# EAGLE design Mouse STM32F401_DB9 v1.1 (EAGLE 7.5.0)
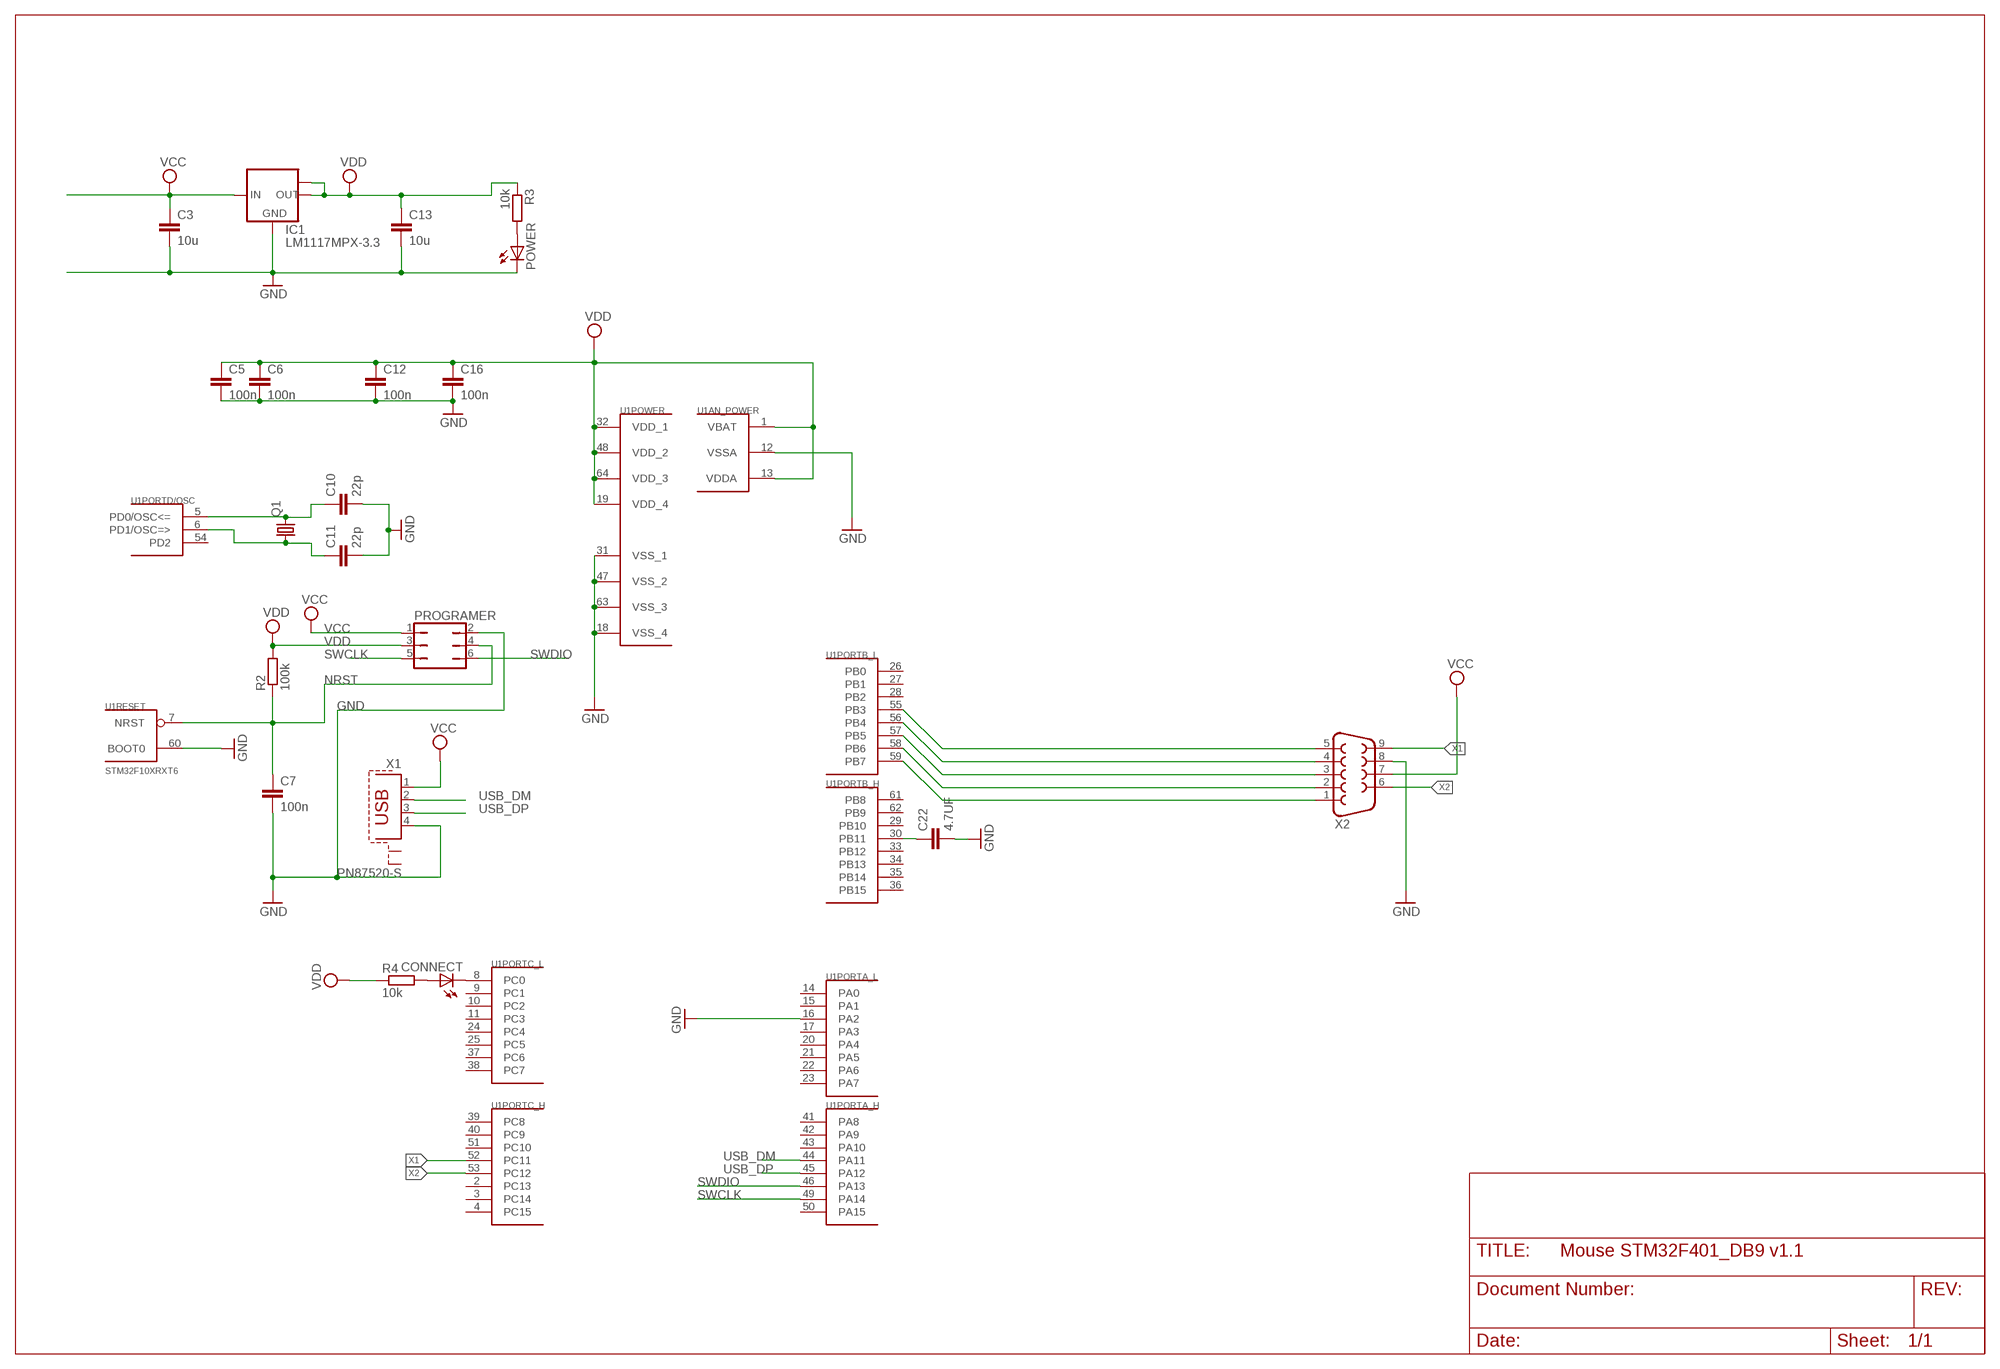
[diagram p0: schematic, sheet 1]

## Parts
C3  10u  C-EUC1206  [C1206]
C5  100n  C-EUC0603  [C0603]
C6  100n  C-EUC0603  [C0603]
C7  100n  C-EUC0603  [C0603]
C10  22p  C-EUC0603  [C0603]
C11  22p  C-EUC0603  [C0603]
C12  100n  C-EUC0603  [C0603]
C13  10u  C-EUC1206  [C1206]
C16  100n  C-EUC0603  [C0603]
C22  4.7UF  C-EUC1206  [C1206]
CONNECT  LEDSML0805  [SML0805]
IC1  LM1117MPX-3.3  [SOT223]
POWER  LEDSML0805  [SML0805]
PROGRAMER  JP3Q  [JP3Q]
Q1  CRYSTALHC49S  [HC49/S]
R2  100k  R-EU_R0603  [R0603]
R3  10k  R-EU_R0603  [R0603]
R4  10k  R-EU_R0603  [R0603]
U1  STM32F10XRXT6  [TQFP64]
X1  PN87520-S  [PN87520-S]
X2  F09HP  [F09HP]

## Nets
GND: C3.2 C5.2 C6.2 C7.2 C10.2 C11.2 C12.2 C13.2 C16.2 C22.2 IC1.1(GND) POWER.C PROGRAMER.2 U1.12(AN_POWER:VSSA) U1.16(PORTA_L:PA2) U1.18(POWER:VSS_4) U1.31(POWER:VSS_1) U1.47(POWER:VSS_2) U1.60(RESET:BOOT0) U1.63(POWER:VSS_3) X1.4 X2.8
N$1: C10.1 Q1.2 U1.5(PORTD/OSC:PD0/OSC<=)
N$2: C11.1 Q1.1 U1.6(PORTD/OSC:PD1/OSC=>)
N$3: CONNECT.C U1.8(PORTC_L:PC0)
N$4: C22.1 U1.30(PORTB_H:PB11)
N$5: U1.55(PORTB_L:PB3) X2.5
N$7: CONNECT.A R4.2
N$8: U1.56(PORTB_L:PB4) X2.4
N$10: U1.58(PORTB_L:PB6) X2.2
N$12: POWER.A R3.2
N$20: U1.59(PORTB_L:PB7) X2.1
N$22: U1.57(PORTB_L:PB5) X2.3
NRST: C7.1 PROGRAMER.4 R2.1 U1.7(RESET:NRST)
SWCLK: PROGRAMER.5 U1.49(PORTA_H:PA14)
SWDIO: PROGRAMER.6 U1.46(PORTA_H:PA13)
USB_DM: U1.44(PORTA_H:PA11) X1.2
USB_DP: U1.45(PORTA_H:PA12) X1.3
VCC: C3.1 IC1.3(IN) PROGRAMER.1 X1.1 X2.7
VDD: C5.1 C6.1 C12.1 C13.1 C16.1 IC1.2(OUT) IC1.TAB(OUT1) PROGRAMER.3 R2.2 R3.1 R4.1 U1.1(AN_POWER:VBAT) U1.13(AN_POWER:VDDA) U1.19(POWER:VDD_4) U1.32(POWER:VDD_1) U1.48(POWER:VDD_2) U1.64(POWER:VDD_3)
X1: U1.52(PORTC_H:PC11) X2.9
X2: U1.53(PORTC_H:PC12) X2.6
Unconnected: U1.2(PORTC_H:PC13) U1.3(PORTC_H:PC14) U1.4(PORTC_H:PC15) U1.9(PORTC_L:PC1) U1.10(PORTC_L:PC2) U1.11(PORTC_L:PC3) U1.14(PORTA_L:PA0) U1.15(PORTA_L:PA1) U1.17(PORTA_L:PA3) U1.20(PORTA_L:PA4) U1.21(PORTA_L:PA5) U1.22(PORTA_L:PA6) U1.23(PORTA_L:PA7) U1.24(PORTC_L:PC4) U1.25(PORTC_L:PC5) U1.26(PORTB_L:PB0) U1.27(PORTB_L:PB1) U1.28(PORTB_L:PB2) U1.29(PORTB_H:PB10) U1.33(PORTB_H:PB12) U1.34(PORTB_H:PB13) U1.35(PORTB_H:PB14) U1.36(PORTB_H:PB15) U1.37(PORTC_L:PC6) U1.38(PORTC_L:PC7) U1.39(PORTC_H:PC8) U1.40(PORTC_H:PC9) U1.41(PORTA_H:PA8) U1.42(PORTA_H:PA9) U1.43(PORTA_H:PA10) U1.50(PORTA_H:PA15) U1.51(PORTC_H:PC10) U1.54(PORTD/OSC:PD2) U1.61(PORTB_H:PB8) U1.62(PORTB_H:PB9) X1.S1 X1.S2

## Library data of the parts
C3 C5-C7 C10-C13 C16 C22 = rcl:C-EU: CAPACITOR, European symbol; SPICEPREFIX: C
CONNECT POWER = led:LED: LED OSRAM: - CHIPLED LG R971, LG N971, LY N971, LG Q971, LY Q971, LO R971, LY R971 LH N974, LH R974 LS Q976, LO Q976, LY Q976 LO Q996 - Hyper CHIPLED LW Q18S LB Q993, LB Q99A, LB R99A - SideLED LS A670, LO A670, LY A670, LG A670, LP A670 LB A673, LV A673, LT A673, LW A673 LH A674 LY A675 LS A676, LA A676, LO A676, LY A676, LW A676 LS A679, LY A679, LG A679 - Hyper Micro SIDELED® LS Y876, LA Y876, LO Y876, LY Y876 LT Y87S - SmartLED LW L88C, LW L88S LB L89C, LB L89S, LG L890 LS L89K, LO L89K, LY L89K LS L896, LA L896, LO L896, LY L896 - TOPLED LS T670, LO T670, LY T670, LG T670, LP T670 LSG T670, LSP T670, LSY T670, LOP T670, LYG T670 LG T671, LOG T671, LSG T671 LB T673, LV T673, LT T673, LW T673 LH T674 LS T676, LA T676, LO T676, LY T676, LB T676, LH T676, LSB T676, LW T676 LB T67C, LV T67C, LT T67C, LS T67K, LO T67K, LY T67K, LW E67C LS E67B, LA E67B, LO E67B, LY E67B, LB E67C, LV E67C, LT E67C LW T67C LS T679, LY T679, LG T679 LS T770, LO T770, LY T770, LG T770, LP T770 LB T773, LV T773, LT T773, LW T773 LH T774 LS E675, LA E675, LY E675, LS T675 LS T776, LA T776, LO T776, LY T776, LB T776 LHGB T686 LT T68C, LB T68C - Hyper Mini TOPLED® LB M676 - Mini TOPLED Santana® LG M470 LS M47K, LO M47K, LY M47K Source: http://www.osram.convergy.de LUXEON: - LUMILED® LXK2-PW12-R00, LXK2-PW12-S00, LXK2-PW14-U00, LXK2-PW14-V00 LXK2-PM12-R00, LXK2-PM12-S00, LXK2-PM14-U00 LXK2-PE12-Q00, LXK2-PE12-R00, LXK2-PE12-S00, LXK2-PE14-T00, LXK2-PE14-U00 LXK2-PB12-K00, LXK2-PB12-L00, LXK2-PB12-M00, LXK2-PB14-N00, LXK2-PB14-P00, LXK2-PB14-Q00 LXK2-PR12-L00, LXK2-PR12-M00, LXK2-PR14-Q00, LXK2-PR14-R00 LXK2-PD12-Q00, LXK2-PD12-R00, LXK2-PD12-S00 LXK2-PH12-R00, LXK2-PH12-S00 LXK2-PL12-P00, LXK2-PL12-Q00, LXK2-PL12-R00 Source: www.luxeon.com KINGBRIGHT: KA-3528ASYC Source: www.kingbright.com
IC1 = lm1117:LM1117MPX-*
PROGRAMER = jumper:JP3Q: JUMPER
Q1 = crystal:CRYSTAL: CRYSTAL; OC_FARNELL: 1667008; OC_NEWARK: unknown
R2-R4 = rcl:R-EU_: RESISTOR, European symbol; SPICEPREFIX: R
U1 = stm32:STM32F10XRXT6: STM32F101/103 64pin LQFP
X1 = con-berg:PN87520-S; OC_FARNELL: unknown; OC_NEWARK: unknown
X2 = con-subd:F09: SUB-D; OC_FARNELL: unknown; OC_NEWARK: unknown

## Board
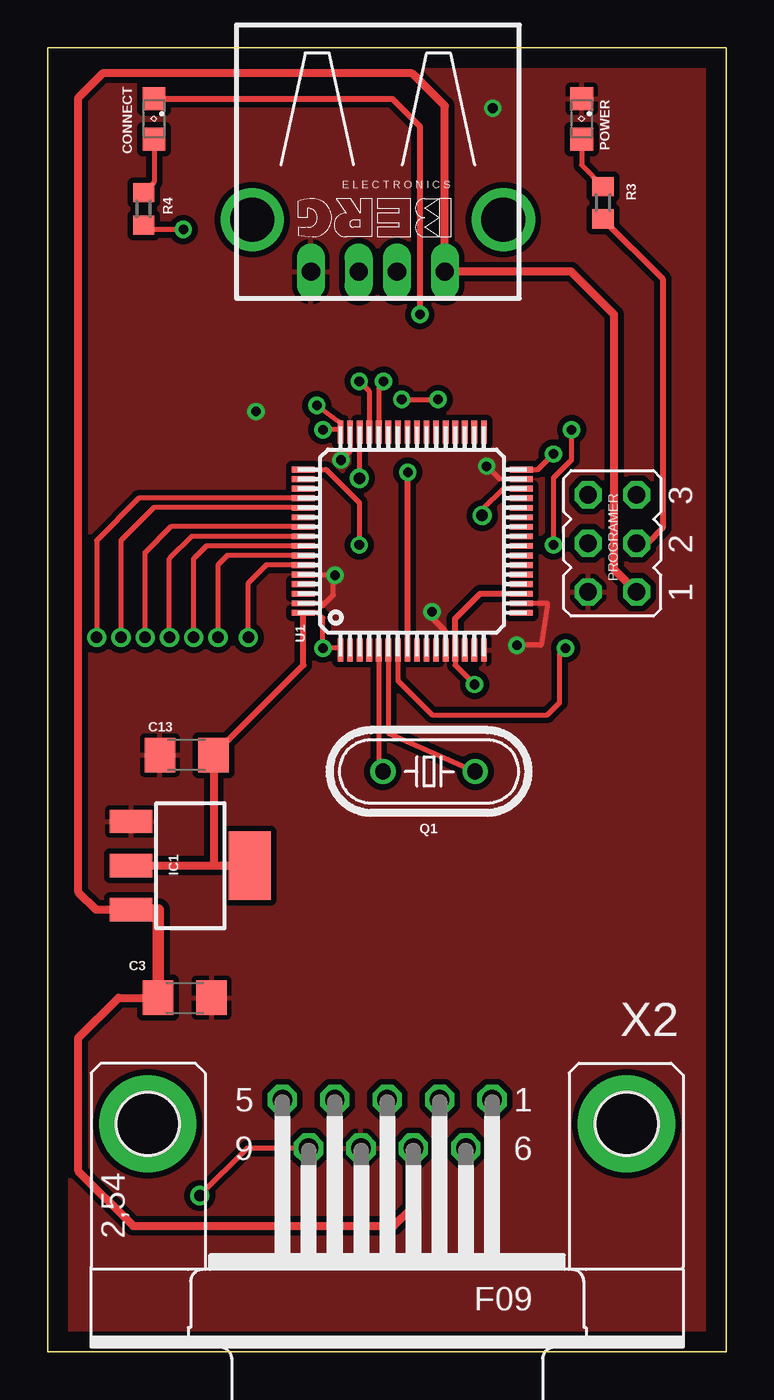
[diagram p1: board, top side]
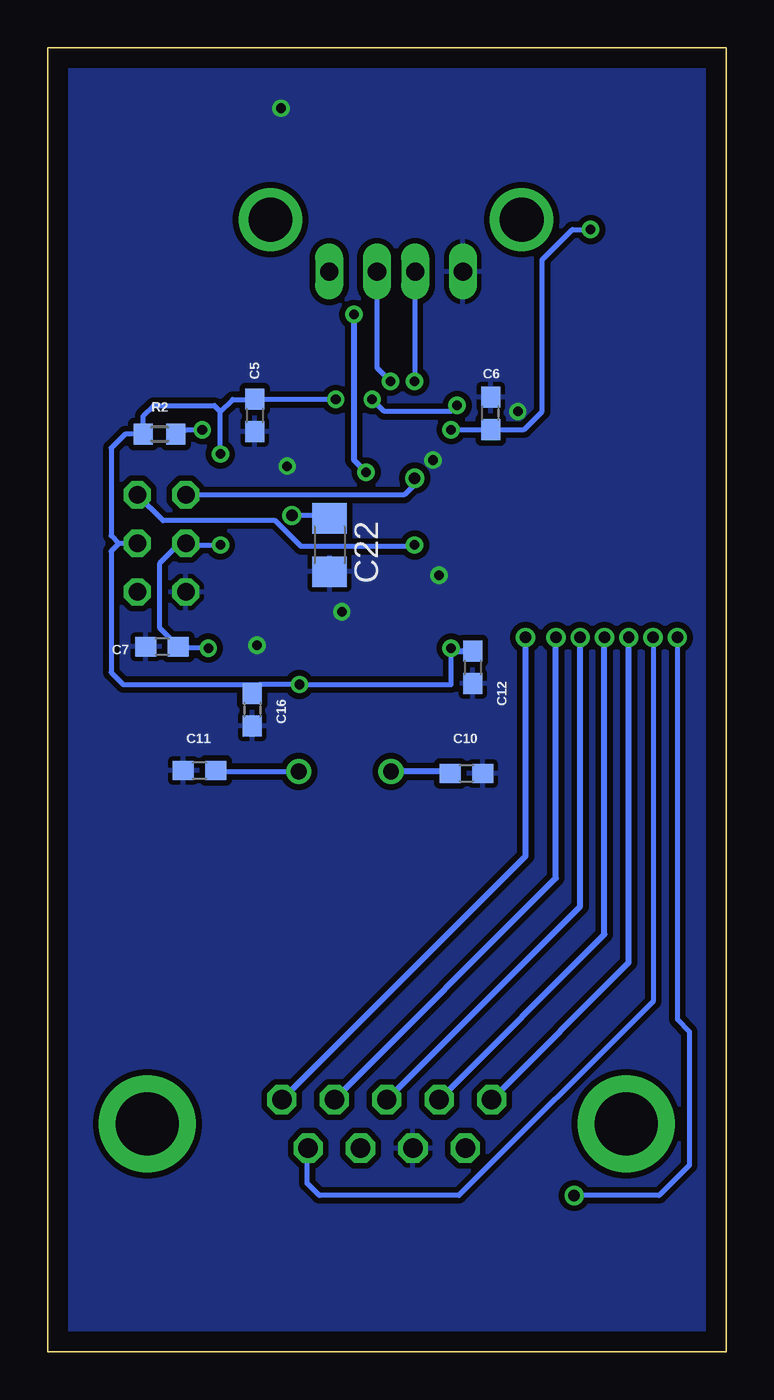
[diagram p2: board, bottom side, seen from below]

Size 35.49 x 68.25 mm. Coordinates in mm from the lower left corner, seen from the top.
Outline: 0,0 0,68.25 35.49,68.25 35.49,0 0,0
Copper layers (1*16): Top 0.035mm / dielectric 1.5mm / Bottom 0.035mm
Design rules "default": minimum track width 6mil, minimum drill 0.35mm, track to track 6mil, track to pad 6mil, pad to pad 6mil, via to via 6mil, smd to smd 6mil, copper to edge 40mil, drill to drill 6mil, minimum pad ring 10mil, minimum via ring 8mil, stop-mask expansion 4mil, vias tented up to drill 0mil, thermal gap 10mil

### Footprints (pad centres in the part's own frame; a part is rotated, then mirrored left to right if it is on the bottom)
C1206 = smd 1.6 x 1.8: 1 -1.4,0; 2 1.4,0
C0603 = smd 1.1 x 1: 1 -0.85,0; 2 0.85,0
SML0805 = smd 1.2 x 1.2: A 1.05,0; C -1.05,0
SOT223 = smd 1.219 x 2.235: 1 -2.311,-3.099; 2 0,-3.099; 3 2.311,-3.099 | smd 3.6 x 2.2: TAB 0,3.099
JP3Q = drill 0.914 octagon: 1 -2.54,-1.27; 2 -2.54,1.27; 3 0,-1.27; 4 0,1.27; 5 2.54,-1.27; 6 2.54,1.27
HC49/S = drill 0.813: 1 -2.413,0; 2 2.413,0
R0603 = smd 1 x 1.1: 1 -0.85,0; 2 0.85,0
TQFP64 = smd 1.2 x 0.3: 1 -5.7,3.75; 2 -5.7,3.25; 3 -5.7,2.75; 4 -5.7,2.25; 5 -5.7,1.75; 6 -5.7,1.25; 7 -5.7,0.75; 8 -5.7,0.25; 9 -5.7,-0.25; 10 -5.7,-0.75; 11 -5.7,-1.25; 12 -5.7,-1.75; 13 -5.7,-2.25; 14 -5.7,-2.75; 15 -5.7,-3.25; 16 -5.7,-3.75; 33 5.7,-3.75; 34 5.7,-3.25; 35 5.7,-2.75; 36 5.7,-2.25; 37 5.7,-1.75; 38 5.7,-1.25; 39 5.7,-0.75; 40 5.7,-0.25; 41 5.7,0.25; 42 5.7,0.75; 43 5.7,1.25; 44 5.7,1.75; 45 5.7,2.25; 46 5.7,2.75; 47 5.7,3.25; 48 5.7,3.75 | smd 0.3 x 1.2: 17 -3.75,-5.7; 18 -3.25,-5.7; 19 -2.75,-5.7; 20 -2.25,-5.7; 21 -1.75,-5.7; 22 -1.25,-5.7; 23 -0.75,-5.7; 24 -0.25,-5.7; 25 0.25,-5.7; 26 0.75,-5.7; 27 1.25,-5.7; 28 1.75,-5.7; 29 2.25,-5.7; 30 2.75,-5.7; 31 3.25,-5.7; 32 3.75,-5.7; 49 3.75,5.7; 50 3.25,5.7; 51 2.75,5.7; 52 2.25,5.7; 53 1.75,5.7; 54 1.25,5.7; 55 0.75,5.7; 56 0.25,5.7; 57 -0.25,5.7; 58 -0.75,5.7; 59 -1.25,5.7; 60 -1.75,5.7; 61 -2.25,5.7; 62 -2.75,5.7; 63 -3.25,5.7; 64 -3.75,5.7
PN87520-S = drill 0.95 long: 1 -3.5,2.71; 2 -1,2.71; 3 1,2.71; 4 3.5,2.71 | drill 2.3 pad 2.9: S1 -6.57,0; S2 6.57,0
F09HP = drill 1.016 octagon: 1 -5.486,-1.27; 2 -2.743,-1.27; 3 0,-1.27; 4 2.743,-1.27; 5 5.486,-1.27; 6 -4.115,1.27; 7 -1.372,1.27; 8 1.372,1.27; 9 4.115,1.27 | drill 3.302 pad 5.08: G1 -12.522,0; G2 12.522,0

### Placement (x,y rotation side)
C3  7.17,18.53 0 top
C5  24.67,49 270 bottom
C6  12.32,49.12 90 bottom
C7  29.51,36.9 180 bottom
C10  13.58,30.27 0 bottom
C11  27.56,30.42 180 bottom
C12  13.26,35.82 270 bottom
C13  7.26,31.23 180 top
C16  24.8,33.6 270 bottom
C22  20.74,42.23 270 bottom
CONNECT  5.56,64.52 270 top
IC1  7.46,25.44 270 top
POWER  27.93,64.52 270 top
PROGRAMER  29.54,42.31 90 top
Q1  19.95,30.37 180 top
R2  29.64,48.03 180 bottom
R3  29.05,60.14 90 top
R4  5.01,59.82 90 top
U1  19.07,42.43 90 top
X1  17.27,59.25 180 top
X2  17.76,11.93 180 top

### Tracks (layer width: path | path; a pad name or v marks a point on that pad's centre or on a via)
GND  (via drill 0.5 pad 0.25)
  Top 0.254: U1.18 26.14,39.18 26.14,39.05 25.81,36.98 v24.54,36.98 | U1.47 15.82,47.14 v15.35,46.67 | U1.31 23.64,45.68 v22.97,46.35 | U1.12 20.82,37.71 20.74,37.78 | U1.60 14.67,40.68 14.71,40.64 | 14.39,39.05 14.27,39.18 U1.63 14.51,39.18 14.94,39.61 14.94,40.55 v15.03,40.64
  Top 0.305: 20.74,37.78 20.11,38.42 v20.11,38.73
  other vias: 23.28,65.09 10.9,49.21
  pour Bottom (isolate 0.305): 35.66,68.26 35.66,0 0.11,0 0.11,68.26
  pour Top (isolate 0.305): 35.66,68.26 35.66,0 0.11,0 0.11,68.26
N$1
  Top 0.254: U1.5 17.32,30.37 Q1.2
  Bottom 0.305: C10.1 14.54,30.37 Q1.2
N$2
  Top 0.254: U1.6 17.82,32.38 Q1.1
  Bottom 0.254: C11.1 26.66,30.37 Q1.1
N$3  (via drill 0.5 pad 0.25)
  Top 0.305: CONNECT.C 18.03,65.57 19.47,64.13 v19.47,54.29 | v18.84,46.04 18.82,46.01 U1.8
  Bottom 0.305: v19.47,54.29 19.47,46.67 v18.84,46.04
N$4  (via drill 0.6 pad 0.25)
  Top 0.254: U1.30 23.86,45.18 22.73,44.09 v22.73,43.77
  Bottom 0.254: C22.1 20.89,43.77 v22.73,43.77
N$5  (via drill 0.6)
  Top 0.254: U1.55 6.44,43.18 5.1,41.83 v5.1,37.39
  Bottom 0.305: X2.5 5.1,20.37 v5.1,37.39
N$7
  Top 0.254: CONNECT.A 5.56,61.22 R4.2
N$8  (via drill 0.6)
  Top 0.254: U1.56 7.53,42.68 6.37,41.51 v6.37,37.39
  Bottom 0.305: X2.4 6.37,21.85 v6.37,37.39
N$10  (via drill 0.6)
  Top 0.254: U1.58 9.39,41.68 8.91,41.2 v8.91,37.39
  Bottom 0.305: X2.2 8.91,24.79 v8.91,37.39
N$12
  Top 0.254: POWER.A 27.93,62.11 R3.2
N$20  (via drill 0.6)
  Top 0.254: U1.59 11.43,41.18 10.49,40.24 v10.49,37.39
  Bottom 0.305: X2.1 10.49,25.95 v10.49,37.39
N$22  (via drill 0.6)
  Top 0.254: U1.57 8.3,42.18 7.64,41.51 v7.64,37.39
  Bottom 0.305: X2.3 7.64,23.32 v7.64,37.39
NRST  (via drill 0.5 pad 0.25)
  Top 0.254: v27.09,36.83 26.78,36.51 26.78,33.97 26.14,33.34 20.11,33.34 18.32,35.13 U1.7 | v26.46,42.23 26.46,45.73 27.41,46.68 v27.41,48.26
  Bottom 0.254: v27.09,36.83 28.58,36.83 C7.1 29.63,37.88 29.63,41.27 28.77,42.14 28.77,42.31 PROGRAMER.4 28.13,42.31 28.05,42.23 v26.46,42.23 | R2.1 28.79,47.73 28.26,48.26 v27.41,48.26
SWCLK  (via drill 0.5 pad 0.25)
  Top 0.254: U1.49 14.57,46.18 16.3,44.45 v16.3,42.23
  Bottom 0.254: PROGRAMER.5 29.46,43.5 23.59,43.5 22.24,42.15 16.37,42.15 v16.3,42.23
SWDIO  (via drill 0.6 pad 0.25)
  Top 0.254: v16.3,45.72 16.32,46.05 U1.46
  Bottom 0.254: PROGRAMER.6 16.85,44.85 16.3,45.4 v16.3,45.72
USB_DM  (via drill 0.5 pad 0.25)
  Top 0.254: v17.57,50.8 17.32,50.55 U1.44
  Bottom 0.254: X1.2 18.27,51.5 v17.57,50.8
USB_DP  (via drill 0.5 pad 0.25)
  Top 0.254: v16.3,50.8 16.82,50.28 U1.45
  Bottom 0.254: X1.3 16.3,56.51 v16.3,50.8
VCC
  Top 0.406: PROGRAMER.1 29.63,40.95 29.63,54.29 27.38,56.54 X1.1 20.77,65.21 19.07,66.91 2.87,66.91 1.6,65.64 1.6,24.05 2.52,23.13 5.77,23.13 | X2.7 19.07,10.59 19.07,7.54 18.11,6.59 4.46,6.59 1.6,9.45 1.6,16.43 3.7,18.53 C3.1
  Top 0.61: IC1.3 5.77,23.13 C3.1
VDD  (via drill 0.5 pad 0.25)
  Top 0.254: v14.39,48.26 15.19,48.26 U1.48 15.35,48.1 15.35,48.58 v14.08,49.53 | U1.13 21.32,35.94 v22.33,34.92 | v7.09,58.74 5.25,58.74 R4.1 | U1.19 | U1.32 25.65,46.18 v26.46,46.99 | v18.52,49.85 v20.43,49.85 | U1.64 14.13,38.68 14.39,38.42 v14.39,36.83 15.22,36.83 U1.1
  Top 0.305: C13.1 13.37,35.93 U1.64 | U1.13 21.32,38.37 22.63,39.68 U1.19 | R3.1 32.17,56.17 32.17,43.1 31.38,42.31 PROGRAMER.3
  Top 0.406: IC1.2 8.68,25.44 | 8.68,25.44 IC1.TAB | C13.1 8.68,31.21 8.68,25.44
  Bottom 0.254: v14.39,48.26 14.38,48.27 C6.1 10.57,48.27 9.63,49.21 9.63,57.15 8.04,58.74 v7.09,58.74 | v14.39,36.83 14.39,34.92 v22.33,34.92 24.44,34.92 C16.1 24.45,34.92 31.54,34.92 32.17,35.56 32.17,41.91 31.77,42.31 | PROGRAMER.3 31.77,42.31 | 31.77,42.31 32.17,42.71 32.17,47.31 31.45,48.03 R2.2 30.49,48.99 29.95,49.53 26.78,49.53 26.46,49.21 | v26.46,46.99 26.46,49.21 | 26.46,49.21 25.82,49.85 C5.1 v20.43,49.85 | v18.52,49.85 17.89,49.21 14.39,49.21 v14.08,49.53
  Bottom 0.305: v14.39,36.83 14.55,36.67 C12.1
X1  (via drill 0.6)
  Top 0.254: U1.52 4.77,44.68 2.56,42.47 v2.56,37.39 | X2.9 10.43,10.66 v7.95,8.18
  Bottom 0.254: v2.56,37.39 2.56,17.38 1.92,16.75 1.92,9.76 3.51,8.18 v7.95,8.18
X2  (via drill 0.6)
  Top 0.254: U1.53 5.54,44.18 3.83,42.47 v3.83,37.39
  Bottom 0.254: v3.83,37.39 3.83,18.34 13.99,8.18 21.29,8.18 21.92,8.81 21.92,10.61 X2.6

### Text on the board
tValues: 27/8/2022 | kulamario@yahoo.ie | SWDIO | SWCLK | NRST | GND | VCC